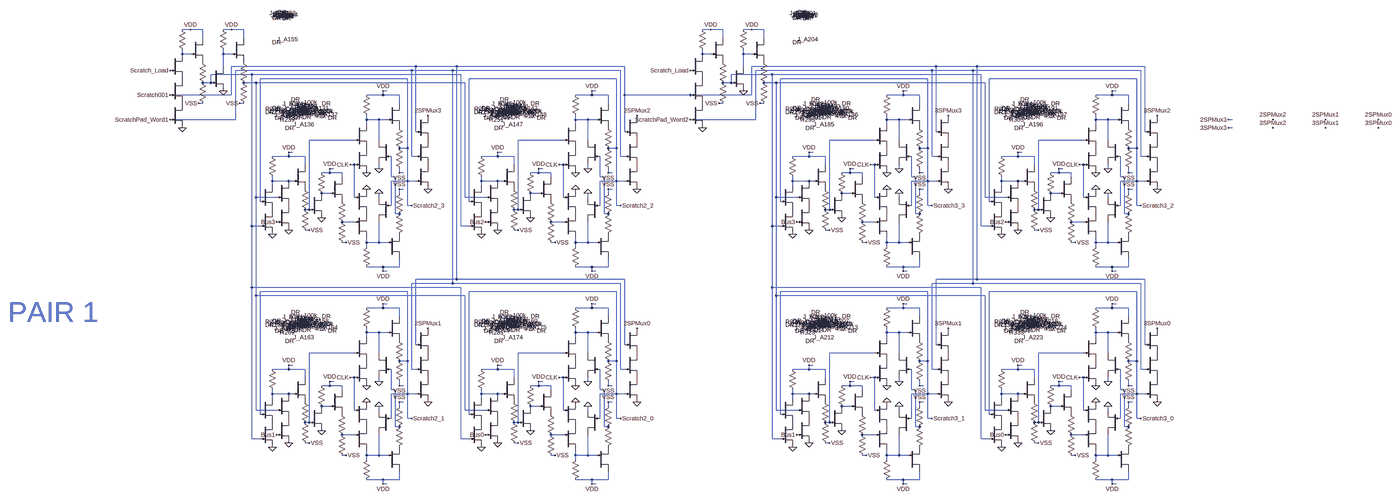
[diagram p0: schematic Pair 2.asc, whole sheet]
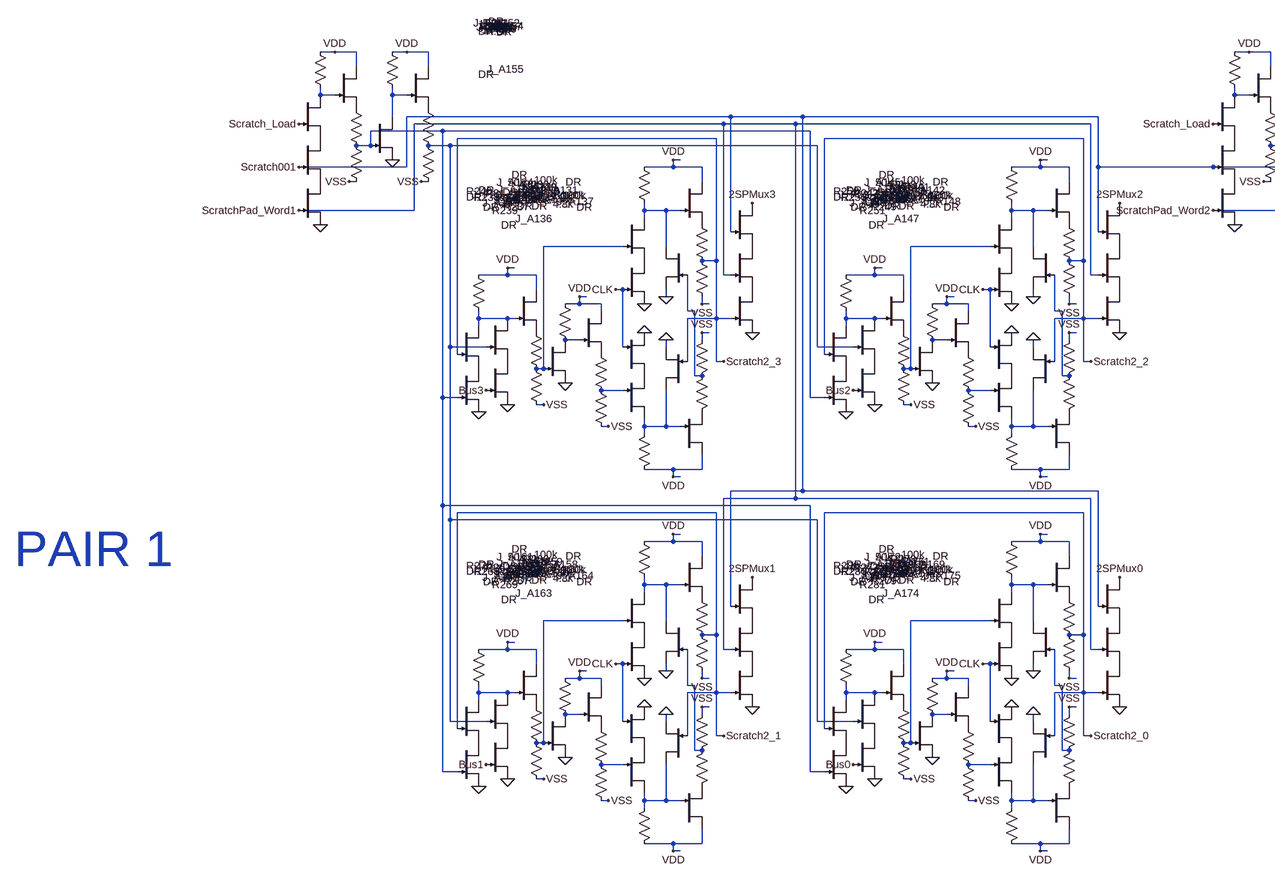
[diagram p1: schematic Pair 2.asc, part, row 1 of 1, column 1 of 2]
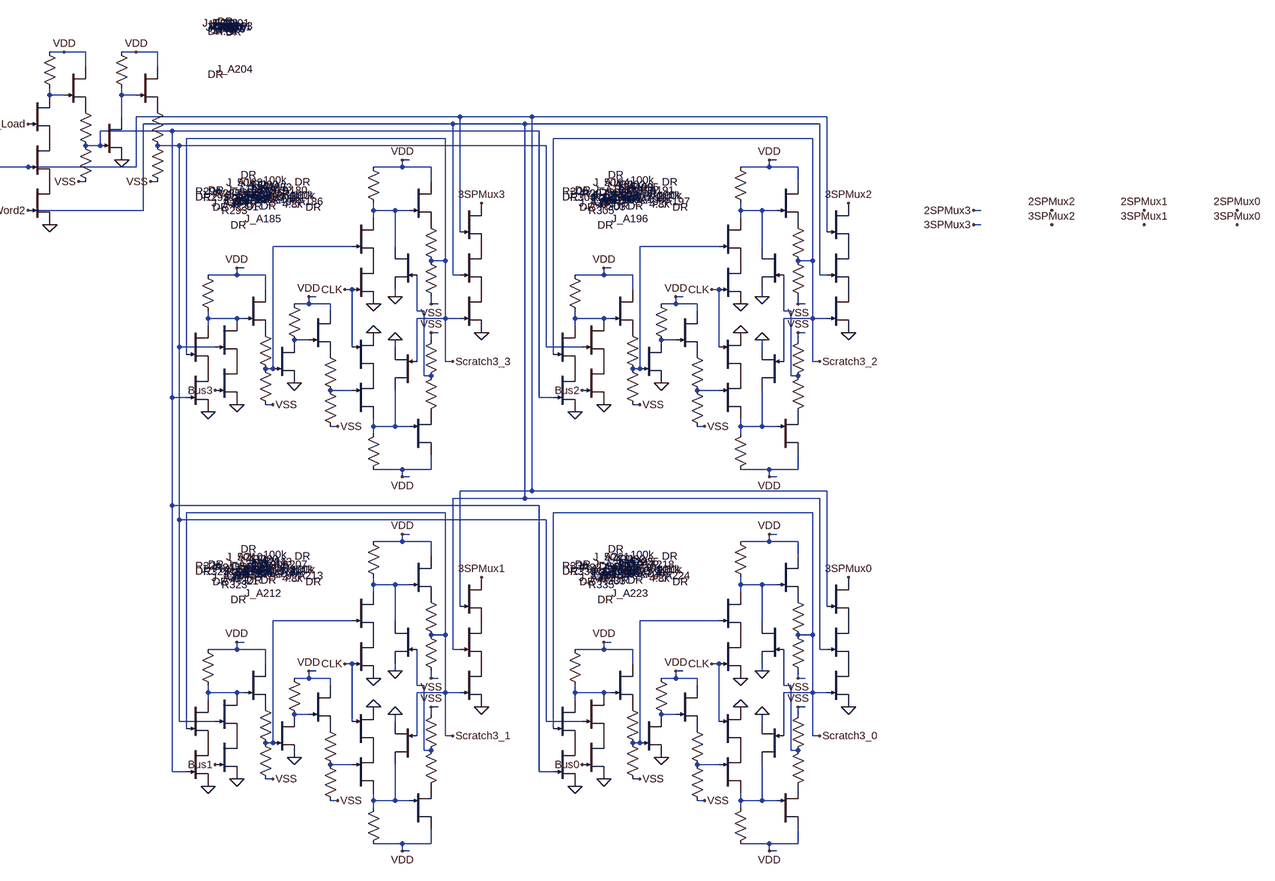
[diagram p2: schematic Pair 2.asc, part, row 1 of 1, column 2 of 2]
* Pair 2.asc
J_A129 N009 N013 P001 DR
R79 VDD N009 100k
J_F20 VDD N009 P002 DR
R80 P002 Scratch2_3 1k
R81 Scratch2_3 VSS 4.8k
J_B49 N009 N017 0 DR
J_A130 N033 N029 P003 DR
R82 VDD N033 100k
J_F21 VDD N033 P004 DR
R83 P004 N017 1k
R84 N017 VSS 4.8k
J_B50 N033 Scratch2_3 0 DR
J_A131 P001 CLK 0 DR
J_A132 P003 CLK 0 DR
J_A133 N021 Scratch2_3 P005 DR
R235 VDD N021 100k
J_F22 VDD N021 P006 DR
R236 P006 N013 1k
R237 N013 VSS 4.8k
J_B51 N021 N007 P007 DR
J_A134 N025 N013 0 DR
R238 VDD N025 50k
J_A135 VDD N025 P008 DR
R239 P008 N029 1k
R240 N029 VSS 4.5k
J_A136 P005 N005 0 DR
J_B52 P007 Bus3 0 DR
J_A137 P009 Scratch2_3 0 DR
J_A138 P010 ScratchPad_Word1 P009 DR
J_A139 2SPMux3 Scratch001 P010 DR
J_A140 N010 N014 P011 DR
R241 VDD N010 100k
J_F23 VDD N010 P012 DR
R242 P012 Scratch2_2 1k
R243 Scratch2_2 VSS 4.8k
J_B53 N010 N018 0 DR
J_A141 N034 N030 P013 DR
R244 VDD N034 100k
J_F24 VDD N034 P014 DR
R245 P014 N018 1k
R246 N018 VSS 4.8k
J_B54 N034 Scratch2_2 0 DR
J_A142 P011 CLK 0 DR
J_A143 P013 CLK 0 DR
J_A144 N022 Scratch2_2 P015 DR
R247 VDD N022 100k
J_F25 VDD N022 P016 DR
R248 P016 N014 1k
R249 N014 VSS 4.8k
J_B55 N022 N007 P017 DR
J_A145 N026 N014 0 DR
R250 VDD N026 50k
J_A146 VDD N026 P018 DR
R251 P018 N030 1k
R252 N030 VSS 4.5k
J_A147 P015 N005 0 DR
J_B56 P017 Bus2 0 DR
J_A148 P019 Scratch2_2 0 DR
J_A149 P020 ScratchPad_Word1 P019 DR
J_A150 2SPMux2 Scratch001 P020 DR
R253 VDD N001 100k
J_F26 VDD N001 P021 DR
R254 P021 N005 1k
R255 N005 VSS 4.8k
J_A151 N002 N005 0 DR
R256 VDD N002 50k
J_A152 VDD N002 P022 DR
R257 P022 N007 1k
R258 VSS N007 4.5k
J_A153 N001 Scratch_Load P023 DR
J_A154 P023 Scratch001 P024 DR
J_A155 P024 ScratchPad_Word1 0 DR
J_A156 N037 N041 P025 DR
R259 VDD N037 100k
J_F27 VDD N037 P026 DR
R260 P026 Scratch2_1 1k
R261 Scratch2_1 VSS 4.8k
J_B57 N037 N045 0 DR
J_A157 N061 N057 P027 DR
R262 VDD N061 100k
J_F28 VDD N061 P028 DR
R263 P028 N045 1k
R264 N045 VSS 4.8k
J_B58 N061 Scratch2_1 0 DR
J_A158 P025 CLK 0 DR
J_A159 P027 CLK 0 DR
J_A160 N049 Scratch2_1 P029 DR
R265 VDD N049 100k
J_F66 VDD N049 P030 DR
R266 P030 N041 1k
R267 N041 VSS 4.8k
J_B59 N049 N007 P031 DR
J_A161 N053 N041 0 DR
R268 VDD N053 50k
J_A162 VDD N053 P032 DR
R269 P032 N057 1k
R270 N057 VSS 4.5k
J_A163 P029 N005 0 DR
J_B60 P031 Bus1 0 DR
J_A164 P033 Scratch2_1 0 DR
J_A165 P034 ScratchPad_Word1 P033 DR
J_A166 2SPMux1 Scratch001 P034 DR
J_A167 N038 N042 P035 DR
R271 VDD N038 100k
J_F67 VDD N038 P036 DR
R272 P036 Scratch2_0 1k
R273 Scratch2_0 VSS 4.8k
J_B61 N038 N046 0 DR
J_A168 N062 N058 P037 DR
R274 VDD N062 100k
J_F68 VDD N062 P038 DR
R275 P038 N046 1k
R276 N046 VSS 4.8k
J_B62 N062 Scratch2_0 0 DR
J_A169 P035 CLK 0 DR
J_A170 P037 CLK 0 DR
J_A171 N050 Scratch2_0 P039 DR
R277 VDD N050 100k
J_F69 VDD N050 P040 DR
R278 P040 N042 1k
R279 N042 VSS 4.8k
J_B63 N050 N007 P041 DR
J_A172 N054 N042 0 DR
R280 VDD N054 50k
J_A173 VDD N054 P042 DR
R281 P042 N058 1k
R282 N058 VSS 4.5k
J_A174 P039 N005 0 DR
J_B64 P041 Bus0 0 DR
J_A175 P043 Scratch2_0 0 DR
J_A176 P044 ScratchPad_Word1 P043 DR
J_A177 2SPMux0 Scratch001 P044 DR
J_A178 N011 N015 P045 DR
R283 VDD N011 100k
J_F70 VDD N011 P046 DR
R284 P046 Scratch3_3 1k
R285 Scratch3_3 VSS 4.8k
J_B65 N011 N019 0 DR
J_A179 N035 N031 P047 DR
R286 VDD N035 100k
J_F72 VDD N035 P048 DR
R287 P048 N019 1k
R288 N019 VSS 4.8k
J_B66 N035 Scratch3_3 0 DR
J_A180 P045 CLK 0 DR
J_A181 P047 CLK 0 DR
J_A182 N023 Scratch3_3 P049 DR
R289 VDD N023 100k
J_F73 VDD N023 P050 DR
R290 P050 N015 1k
R291 N015 VSS 4.8k
J_B67 N023 N008 P051 DR
J_A183 N027 N015 0 DR
R292 VDD N027 50k
J_A184 VDD N027 P052 DR
R293 P052 N031 1k
R294 N031 VSS 4.5k
J_A185 P049 N006 0 DR
J_B68 P051 Bus3 0 DR
J_A186 P053 Scratch3_3 0 DR
J_A187 P054 ScratchPad_Word2 P053 DR
J_A188 3SPMux3 Scratch001 P054 DR
J_A189 N012 N016 P055 DR
R295 VDD N012 100k
J_F74 VDD N012 P056 DR
R296 P056 Scratch3_2 1k
R297 Scratch3_2 VSS 4.8k
J_B69 N012 N020 0 DR
J_A190 N036 N032 P057 DR
R298 VDD N036 100k
J_F75 VDD N036 P058 DR
R299 P058 N020 1k
R300 N020 VSS 4.8k
J_B70 N036 Scratch3_2 0 DR
J_A191 P055 CLK 0 DR
J_A192 P057 CLK 0 DR
J_A193 N024 Scratch3_2 P059 DR
R301 VDD N024 100k
J_F76 VDD N024 P060 DR
R302 P060 N016 1k
R303 N016 VSS 4.8k
J_B71 N024 N008 P061 DR
J_A194 N028 N016 0 DR
R304 VDD N028 50k
J_A195 VDD N028 P062 DR
R305 P062 N032 1k
R306 N032 VSS 4.5k
J_A196 P059 N006 0 DR
J_B72 P061 Bus2 0 DR
J_A197 P063 Scratch3_2 0 DR
J_A198 P064 ScratchPad_Word2 P063 DR
J_A199 3SPMux2 Scratch001 P064 DR
R307 VDD N003 100k
J_F77 VDD N003 P065 DR
R308 P065 N006 1k
R309 N006 VSS 4.8k
J_A200 N004 N006 0 DR
R310 VDD N004 50k
J_A201 VDD N004 P066 DR
R311 P066 N008 1k
R312 VSS N008 4.5k
J_A202 N003 Scratch_Load P067 DR
J_A203 P067 Scratch001 P068 DR
J_A204 P068 ScratchPad_Word2 0 DR
J_A205 N039 N043 P069 DR
R313 VDD N039 100k
J_F81 VDD N039 P070 DR
R314 P070 Scratch3_1 1k
R315 Scratch3_1 VSS 4.8k
J_B73 N039 N047 0 DR
J_A206 N063 N059 P071 DR
R316 VDD N063 100k
J_F85 VDD N063 P072 DR
R317 P072 N047 1k
R318 N047 VSS 4.8k
J_B74 N063 Scratch3_1 0 DR
J_A207 P069 CLK 0 DR
J_A208 P071 CLK 0 DR
J_A209 N051 Scratch3_1 P073 DR
R319 VDD N051 100k
J_F90 VDD N051 P074 DR
R320 P074 N043 1k
R321 N043 VSS 4.8k
J_B75 N051 N008 P075 DR
J_A210 N055 N043 0 DR
R322 VDD N055 50k
J_A211 VDD N055 P076 DR
R323 P076 N059 1k
R324 N059 VSS 4.5k
J_A212 P073 N006 0 DR
J_B76 P075 Bus1 0 DR
J_A213 P077 Scratch3_1 0 DR
J_A214 P078 ScratchPad_Word2 P077 DR
J_A215 3SPMux1 Scratch001 P078 DR
J_A216 N040 N044 P079 DR
R325 VDD N040 100k
J_F91 VDD N040 P080 DR
R326 P080 Scratch3_0 1k
R327 Scratch3_0 VSS 4.8k
J_B77 N040 N048 0 DR
J_A217 N064 N060 P081 DR
R328 VDD N064 100k
J_F92 VDD N064 P082 DR
R329 P082 N048 1k
R330 N048 VSS 4.8k
J_B78 N064 Scratch3_0 0 DR
J_A218 P079 CLK 0 DR
J_A219 P081 CLK 0 DR
J_A220 N052 Scratch3_0 P083 DR
R331 VDD N052 100k
J_F93 VDD N052 P084 DR
R332 P084 N044 1k
R333 N044 VSS 4.8k
J_B79 N052 N008 P085 DR
J_A221 N056 N044 0 DR
R334 VDD N056 50k
J_A222 VDD N056 P086 DR
R335 P086 N060 1k
R336 N060 VSS 4.5k
J_A223 P083 N006 0 DR
J_B80 P085 Bus0 0 DR
J_A224 P087 Scratch3_0 0 DR
J_A225 P088 ScratchPad_Word2 P087 DR
J_A226 3SPMux0 Scratch001 P088 DR
.model NJF NJF
.model PJF PJF
.lib standard.jft
* PAIR 1
.backanno
.end